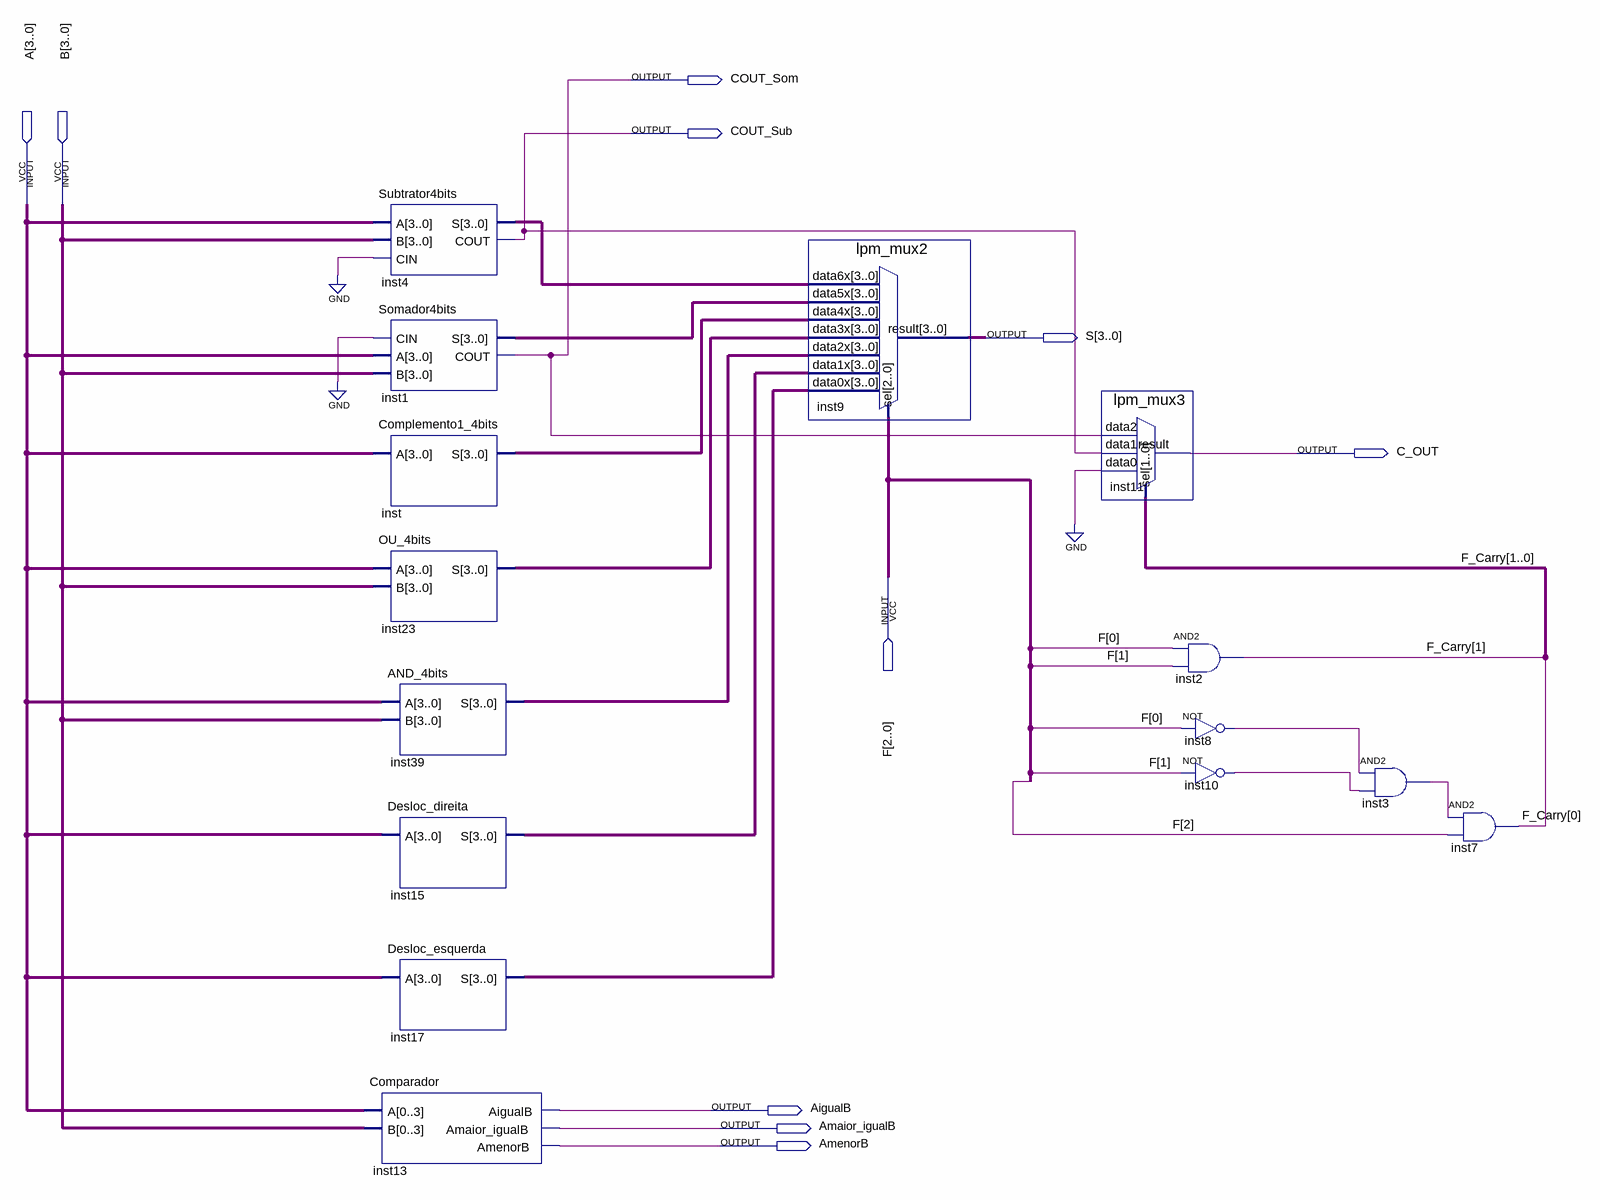
[diagram p0: schematic sheet]
// Quartus schematic ULA.bdf as structural Verilog: 15 symbols, 10 pins
module ULA (
  input  [3:0] A,
  input  [3:0] B,
  input  [2:0] F,
  output COUT_Som,
  output COUT_Sub,
  output [3:0] S,
  output C_OUT,
  output AigualB,
  output Amaior_igualB,
  output AmenorB
);

  wire inst3_out, inst8_out, inst10_out;
  wire [1:0] F_Carry;
  wire [3:0] inst1_s, inst4_s, inst15_s, inst17_s, inst23_s, inst39_s, inst_s;

  Subtrator4bits inst4 (.A(A), .B(B), .CIN(1'b0), .S(inst4_s), .COUT(COUT_Sub));
  Somador4bits inst1 (.CIN(1'b0), .A(A), .B(B), .S(inst1_s), .COUT(COUT_Som));
  Complemento1_4bits inst (.A(A), .S(inst_s));
  OU_4bits inst23 (.A(A), .B(B), .S(inst23_s));
  AND_4bits inst39 (.A(A), .B(B), .S(inst39_s));
  Desloc_direita inst15 (.A(A), .S(inst15_s));
  Desloc_esquerda inst17 (.A(A), .S(inst17_s));
  Comparador inst13 (.A(A), .B(B), .AigualB(AigualB), .Amaior_igualB(Amaior_igualB), .AmenorB(AmenorB));
  lpm_mux2 inst9 (
    .data6x(inst4_s), .data5x(inst1_s), .data4x(inst_s), .data3x(inst23_s), .data2x(inst39_s),
    .data1x(inst15_s), .data0x(inst17_s), .sel(F), .result(S));
  lpm_mux3 inst11 (.data2(COUT_Som), .data1(COUT_Sub), .data0(1'b0), .sel(F_Carry), .result(C_OUT));
  and inst2 (F_Carry[1], F[0], F[1]);
  not inst8 (inst8_out, F[0]);
  not inst10 (inst10_out, F[1]);
  and inst3 (inst3_out, inst8_out, inst10_out);
  and inst7 (F_Carry[0], inst3_out, F[2]);
endmodule
